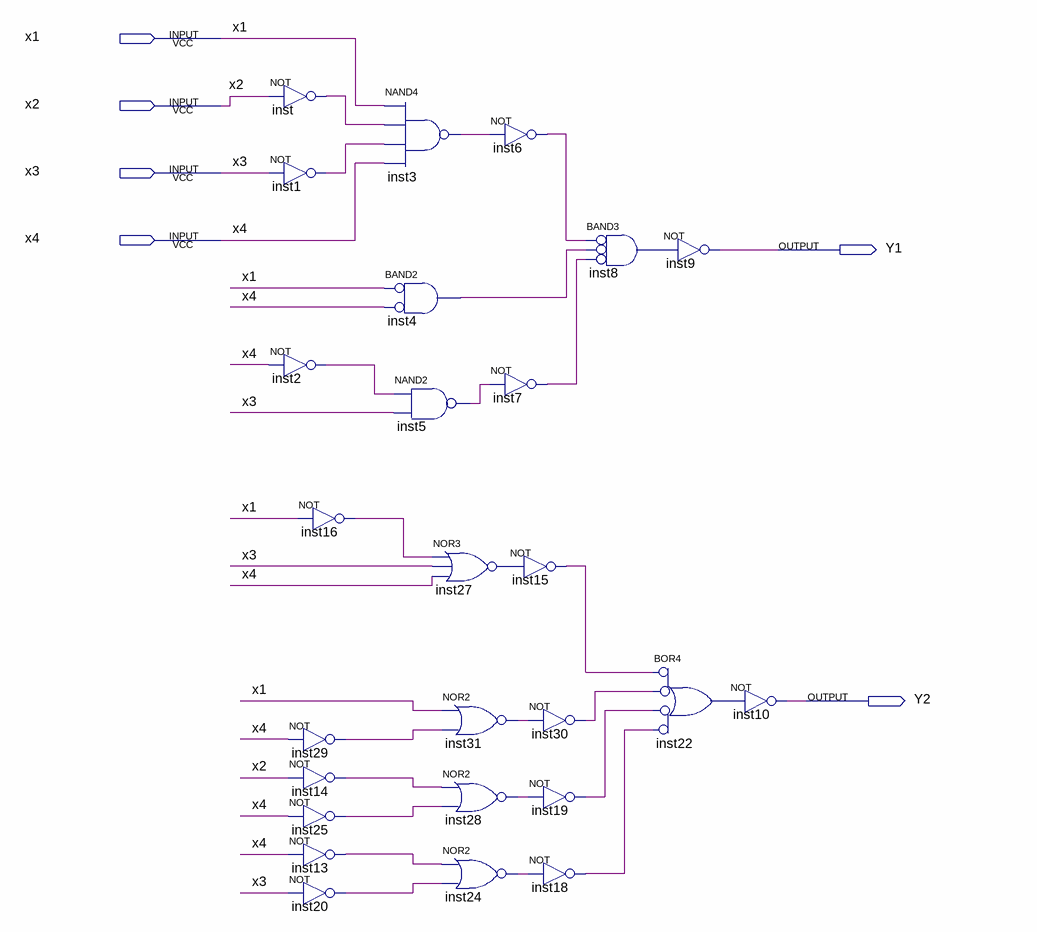
[diagram p0: schematic sheet]
// Quartus schematic Lab1.bdf as structural Verilog: 26 symbols, 6 pins
module Lab1 (
  input  x1,
  input  x2,
  input  x3,
  input  x4,
  output Y1,
  output Y2
);

  wire inst1_out, inst2_out, inst3_out, inst4_out, inst5_out, inst6_out, inst7_out, inst8_out, inst13_out,
       inst14_out, inst15_out, inst16_out, inst18_out, inst19_out, inst20_out, inst22_out, inst24_out,
       inst25_out, inst27_out, inst28_out, inst29_out, inst30_out, inst31_out, inst_out;

  not inst (inst_out, x2);
  not inst1 (inst1_out, x3);
  not inst2 (inst2_out, x4);
  not inst16 (inst16_out, x1);
  not inst29 (inst29_out, x4);
  not inst14 (inst14_out, x2);
  not inst25 (inst25_out, x4);
  not inst13 (inst13_out, x4);
  not inst20 (inst20_out, x3);
  nand inst3 (inst3_out, x1, inst_out, inst1_out, x4);
  and inst4 (inst4_out, ~x1, ~x4);  // BAND2
  nand inst5 (inst5_out, inst2_out, x3);
  nor inst27 (inst27_out, inst16_out, x3, x4);
  not inst6 (inst6_out, inst3_out);
  not inst7 (inst7_out, inst5_out);
  not inst15 (inst15_out, inst27_out);
  nor inst31 (inst31_out, x1, inst29_out);
  nor inst28 (inst28_out, inst14_out, inst25_out);
  nor inst24 (inst24_out, inst13_out, inst20_out);
  and inst8 (inst8_out, ~inst6_out, ~inst4_out, ~inst7_out);  // BAND3
  not inst30 (inst30_out, inst31_out);
  not inst19 (inst19_out, inst28_out);
  not inst18 (inst18_out, inst24_out);
  not inst9 (Y1, inst8_out);
  or inst22 (inst22_out, ~inst15_out, ~inst30_out, ~inst19_out, ~inst18_out);  // BOR4
  not inst10 (Y2, inst22_out);
endmodule
